# Altium schematic sheet plsoxmeter.SchDoc: Pulse oximeter
size A4; Revision: 1; SheetNumber: 5; SheetTotal: 9
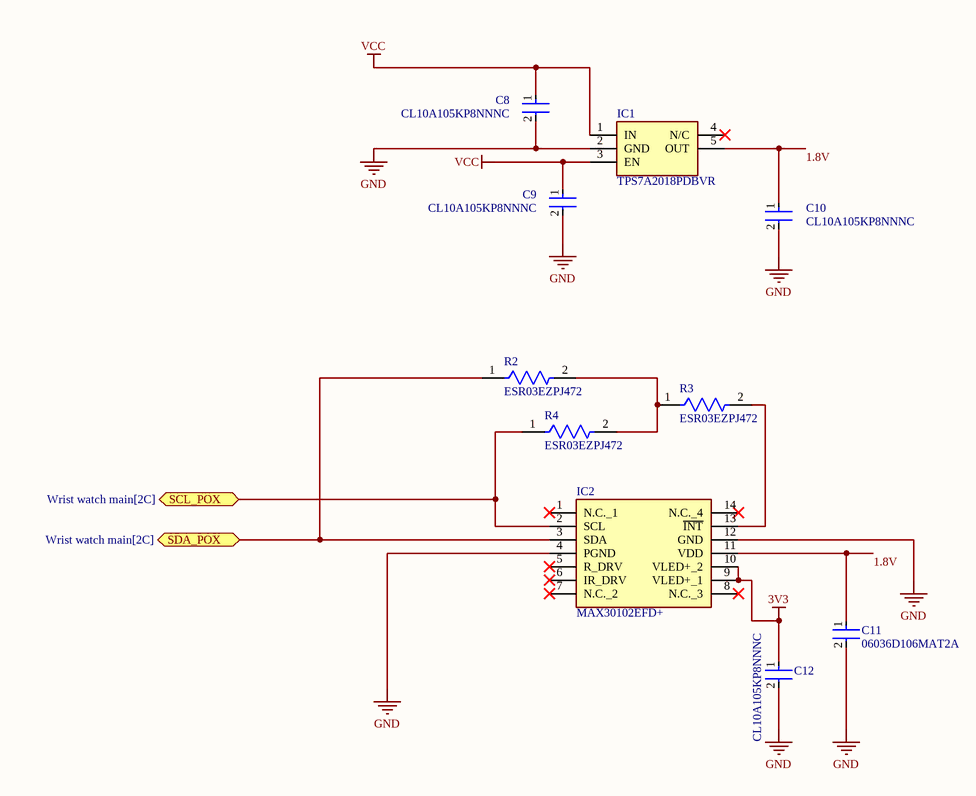
[diagram p0: plsoxmeter.SchDoc]

## Parts
C8  CL10A105KP8NNNC  [FP-CL10-IPC_C]
C9  CL10A105KP8NNNC  [FP-CL10-IPC_C]
C10  CL10A105KP8NNNC  [FP-CL10-IPC_C]
C11  06036D106MAT2A  [FP-0603-L_1_6_0_15-W_0_81-IPC_B]
C12  CL10A105KP8NNNC  [FP-CL10-IPC_C]
IC1  TPS7A2018PDBVR  [SOT95P280X145-5N]
IC2  MAX30102EFD+  [14-LEAD-OESIP]
R2  ESR03EZPJ472  [FP-ESR03-IPC_A]
R3  ESR03EZPJ472  [FP-ESR03-IPC_A]
R4  ESR03EZPJ472  [FP-ESR03-IPC_A]

## Ports
SCL_POX (bidir, see Wrist watch main[2C]), SDA_POX (bidir, see Wrist watch main[2C])

## Nets
3V3: C12.1 IC2.9(VLED+_1) IC2.10(VLED+_2)
GND: C8.2 C9.2 C10.2 C11.2 C12.2 IC1.2(GND) IC2.4(PGND) IC2.12(GND)
VCC: C8.1 C9.1 IC1.1(IN) IC1.3(EN)
1.8V: C10.1 C11.1 IC1.5(OUT) IC2.11(VDD)
SCL_POX: IC2.2(SCL) R4.1 ; port SCL_POX
SDA_POX: IC2.3(SDA) R2.1 ; port SDA_POX
NetIC2_13: IC2.13(~{INT}) R3.2
NetR2_2: R2.2 R3.1 R4.2

Not connected (* = marked no-connect by the designer): IC1 4(N/C)*; IC2 1(N.C._1)* 5(R_DRV)* 6(IR_DRV)* 7(N.C._2)* 8(N.C._3)* 14(N.C._4)*

## Notes on the sheet
- Title:
- Size:
- Document Number :
- Revision
- Drawn by:
- Checked by:
- Date:
- A4
- Time:
- Aprooved by:
- Sheet:
- of
- File:
- URL:

## Library data of the parts
C8-C10 C12 = CMP-13271-003399-1: Cap Ceramic 1uF 10V X5R ±10% Pad SMD 0603 +85°C T/R; Min Operating Temperature: -55°C; Max Operating Temperature: 85°C; Dielectric: X5R; Contact Plating: Tin; Height: 0.8mm; Voltage: 10V; Packaging: Tape and Reel; Voltage Rating: 10V; Capacitance: 1uF; Package Quantity: 1; Width: 0.031inch; Length: 1.6mm; Depth: 0.8mm; Case/Package: 0603; Case Code (Imperial): 0603; Thickness: 0.035inch; Radiation Hardening: No; Tolerance: 10%; Case Code (Metric): 1608; Mount: Surface Mount
C11 = CMP-2006-04476-2: General Purpose Ceramic Capacitor, 0603, 10uF, 20%, X5R, 15%, 6.3V; RoHS Compliant: Yes; Case Code (Imperial): 0603; Construction: Flat; Thickness: 0.035inch; Height: 0.9mm; Number of Pins: 2; Max Operating Temperature: 85°C; Capacitance: 10uF; Length: 1.6mm; REACH SVHC: No SVHC; Width: 0.032inch; Voltage Rating (DC): 6.3V; Termination: SMD/SMT; Contact Plating: Tin; Min Operating Temperature: -55°C; Depth: 0.81mm; Packaging: Tape and Reel; Case Code (Metric): 1608; Voltage Rating: 6.3V; Lead Free: Lead Free; Mount: Surface Mount; Radiation Hardening: No; Series: -; Dielectric Material: Ceramic; Package Quantity: 1; Case/Package: 0603; Tolerance: 20%; Dielectric: X5R; Voltage: 6.3V
IC1 = TPS7A2018PDBVR: Integrated Circuit; Manufacturer_Name: Texas Instruments; Datasheet Link: https://datasheet.datasheetarchive.com/originals/distributors/Datasheets_SAMA/e65d9d311cedf91014769949f3101225.pdf; Height: 1.45mm; Manufacturer_Part_Number: TPS7A2018PDBVR; Mouser Part Number: 595-TPS7A2018PDBVR; Mouser Price/Stock: https://www.mouser.co.uk/ProductDetail/Texas-Instruments/TPS7A2018PDBVR?qs=hd1VzrDQEGheW9qdrIVGew%3D%3D; Arrow Part Number: TPS7A2018PDBVR; Arrow Price/Stock: https://www.arrow.com/en/products/tps7a2018pdbvr/texas-instruments?region=nac
IC2 = MAX30102EFD+: Integrated Circuit; Manufacturer_Name: Analog Devices; Datasheet Link: https://datasheets.maximintegrated.com/en/ds/MAX30102.pdf; Manufacturer_Part_Number: MAX30102EFD+; Mouser Part Number: 700-MAX30102EFD+; Mouser Price/Stock: https://www.mouser.co.uk/ProductDetail/Analog-Devices-Maxim-Integrated/MAX30102EFD%2b?qs=nVS1qgv%252BQrk9UYEvS27V%2Fg%3D%3D
R2-R4 = CMP-08839-007853-1: 4.7kΩ ±5% 0.25W 0603 Anti-Surge Chip Resistor AEC-Q200; Max Power Dissipation: 250mW; Resistance: 4.7kR; Temperature Coefficient: 200ppm/°C; Packaging: Tape and Reel; Series: ESR; Height: 0.022inch; Case Code (Imperial): 0603; Tolerance: 5%; RoHS Compliant: Yes; Case/Package: 0603; Min Operating Temperature: -55°C; Resistor Type: Thick Film; Package Quantity: 5000; Features: Automotive AEC-Q200; Width: 0.031inch; Length: 0.063inch; Max Operating Temperature: 155°C; Number of Terminations: 2